# EAGLE design Aux Board V7.1 (EAGLE 9.6.2)

## Sheet 1 of 2
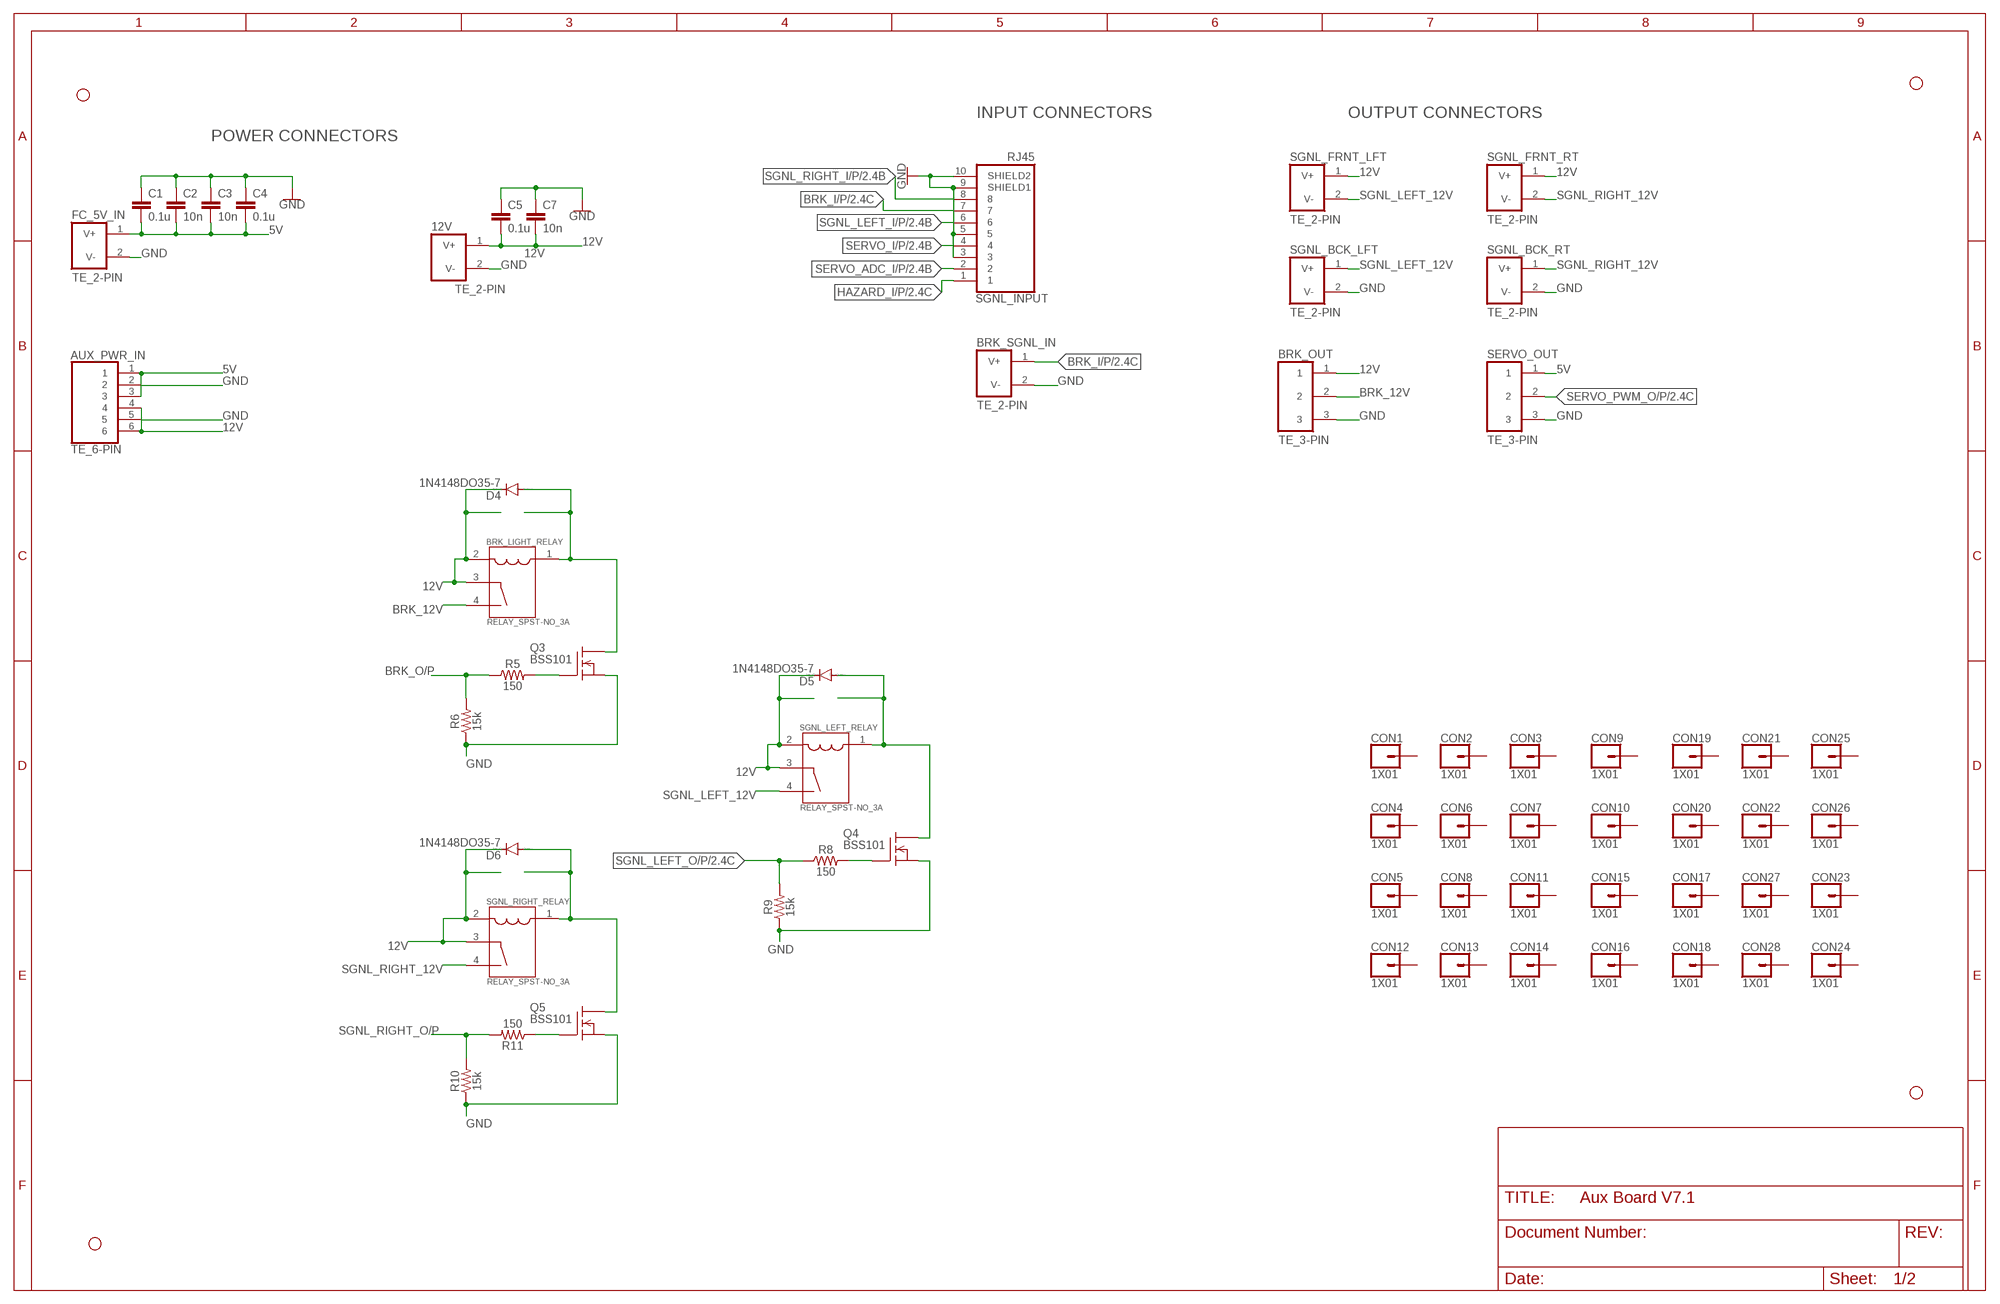
[diagram p0: schematic, sheet 1]

### Parts
12V  TE_2-PIN  [TE_2-PIN]
AUX_PWR_IN  TE_6-PIN  [TE_6-PIN]
BRK_LIGHT_RELAY  RELAY_SPST-NO_3A  [TE_1-1721081-2]
BRK_OUT  TE_3-PIN  [TE_3-PIN]
BRK_SGNL_IN  TE_2-PIN  [TE_2-PIN]
C1  0.1u  CAPACITOR_0805  [0805]
C2  10n  CAPACITOR_0805  [0805]
C3  10n  CAPACITOR_0805  [0805]
C4  0.1u  CAPACITOR_0805  [0805]
C5  0.1u  CAPACITOR_0805  [0805]
C7  10n  CAPACITOR_0805  [0805]
CON1  1X01  [1X01]
CON2  1X01  [1X01]
CON3  1X01  [1X01]
CON4  1X01  [1X01]
CON5  1X01  [1X01]
CON6  1X01  [1X01]
CON7  1X01  [1X01]
CON8  1X01  [1X01]
CON9  1X01  [1X01]
CON10  1X01  [1X01]
CON11  1X01  [1X01]
CON12  1X01  [1X01]
CON13  1X01  [1X01]
CON14  1X01  [1X01]
CON15  1X01  [1X01]
CON16  1X01  [1X01]
CON17  1X01  [1X01]
CON18  1X01  [1X01]
CON19  1X01  [1X01]
CON20  1X01  [1X01]
CON21  1X01  [1X01]
CON22  1X01  [1X01]
CON23  1X01  [1X01]
CON24  1X01  [1X01]
CON25  1X01  [1X01]
CON26  1X01  [1X01]
CON27  1X01  [1X01]
CON28  1X01  [1X01]
D4  1N4148DO35-7  [DO35-7]
D5  1N4148DO35-7  [DO35-7]
D6  1N4148DO35-7  [DO35-7]
FC_5V_IN  TE_2-PIN  [TE_2-PIN]
H1  STAND-OFF  [STAND-OFF]
H2  STAND-OFF  [STAND-OFF]
H3  STAND-OFF  [STAND-OFF]
H4  STAND-OFF  [STAND-OFF]
Q3  BSS101  [TO92]
Q4  BSS101  [TO92]
Q5  BSS101  [TO92]
R5  150  RESISTOR_0805  [0805]
R6  15k  RESISTOR_0805  [0805]
R8  150  RESISTOR_0805  [0805]
R9  15k  RESISTOR_0805  [0805]
R10  15k  RESISTOR_0805  [0805]
R11  150  RESISTOR_0805  [0805]
SERVO_OUT  TE_3-PIN  [TE_3-PIN]
SGNL_BCK_LFT  TE_2-PIN  [TE_2-PIN]
SGNL_BCK_RT  TE_2-PIN  [TE_2-PIN]
SGNL_FRNT_LFT  TE_2-PIN  [TE_2-PIN]
SGNL_FRNT_RT  TE_2-PIN  [TE_2-PIN]
SGNL_INPUT  RJ45  [RJ45]
SGNL_LEFT_RELAY  RELAY_SPST-NO_3A  [TE_1-1721081-2]
SGNL_RIGHT_RELAY  RELAY_SPST-NO_3A  [TE_1-1721081-2]

### Nets
5V: AUX_PWR_IN.1 AUX_PWR_IN.3 C1.2 C2.2 C3.2 C4.2 FC_5V_IN.1(V+) SERVO_OUT.1 ; also sheet 2
12V: 12V.1(V+) AUX_PWR_IN.4 AUX_PWR_IN.6 BRK_LIGHT_RELAY.2 BRK_LIGHT_RELAY.3 BRK_OUT.1 C5.2 C7.2 D4.C D5.C D6.C SGNL_FRNT_LFT.1(V+) SGNL_FRNT_RT.1(V+) SGNL_LEFT_RELAY.2 SGNL_LEFT_RELAY.3 SGNL_RIGHT_RELAY.2 SGNL_RIGHT_RELAY.3
BRK_12V: BRK_LIGHT_RELAY.4 BRK_OUT.2
BRK_I/P: BRK_SGNL_IN.1(V+) SGNL_INPUT.7 ; also sheet 2
BRK_O/P: R5.1 R6.2 ; also sheet 2
GND: 12V.2(V-) AUX_PWR_IN.2 AUX_PWR_IN.5 BRK_OUT.3 BRK_SGNL_IN.2(V-) C1.1 C2.1 C3.1 C4.1 C5.1 C7.1 FC_5V_IN.2(V-) Q3.1(S) Q4.1(S) Q5.1(S) R6.1 R9.1 R10.1 SERVO_OUT.3 SGNL_BCK_LFT.2(V-) SGNL_BCK_RT.2(V-) SGNL_INPUT.3 SGNL_INPUT.5 SGNL_INPUT.9(SHIELD1) SGNL_INPUT.10(SHIELD2) ; also sheet 2
HAZARD_I/P: SGNL_INPUT.1 ; also sheet 2
N$1: BRK_LIGHT_RELAY.1 D4.A Q3.3(D)
N$28: Q3.2(G) R5.2
N$32: D5.A Q4.3(D) SGNL_LEFT_RELAY.1
N$33: Q4.2(G) R8.2
N$35: D6.A Q5.3(D) SGNL_RIGHT_RELAY.1
N$37: Q5.2(G) R11.1
SERVO_ADC_I/P: SGNL_INPUT.2 ; also sheet 2
SERVO_I/P: SGNL_INPUT.4 ; also sheet 2
SERVO_PWM_O/P: SERVO_OUT.2 ; also sheet 2
SGNL_LEFT_12V: SGNL_BCK_LFT.1(V+) SGNL_FRNT_LFT.2(V-) SGNL_LEFT_RELAY.4
SGNL_LEFT_I/P: SGNL_INPUT.6 ; also sheet 2
SGNL_LEFT_O/P: R8.1 R9.2 ; also sheet 2
SGNL_RIGHT_12V: SGNL_BCK_RT.1(V+) SGNL_FRNT_RT.2(V-) SGNL_RIGHT_RELAY.4
SGNL_RIGHT_I/P: SGNL_INPUT.8 ; also sheet 2
SGNL_RIGHT_O/P: R10.2 R11.2 ; also sheet 2
Unconnected: CON1.1 CON2.1 CON3.1 CON4.1 CON5.1 CON6.1 CON7.1 CON8.1 CON9.1 CON10.1 CON11.1 CON12.1 CON13.1 CON14.1 CON15.1 CON16.1 CON17.1 CON18.1 CON19.1 CON20.1 CON21.1 CON22.1 CON23.1 CON24.1 CON25.1 CON26.1 CON27.1 CON28.1

### Notes on the sheet
- INPUT CONNECTORS | OUTPUT CONNECTORS
- POWER CONNECTORS

## Sheet 2 of 2
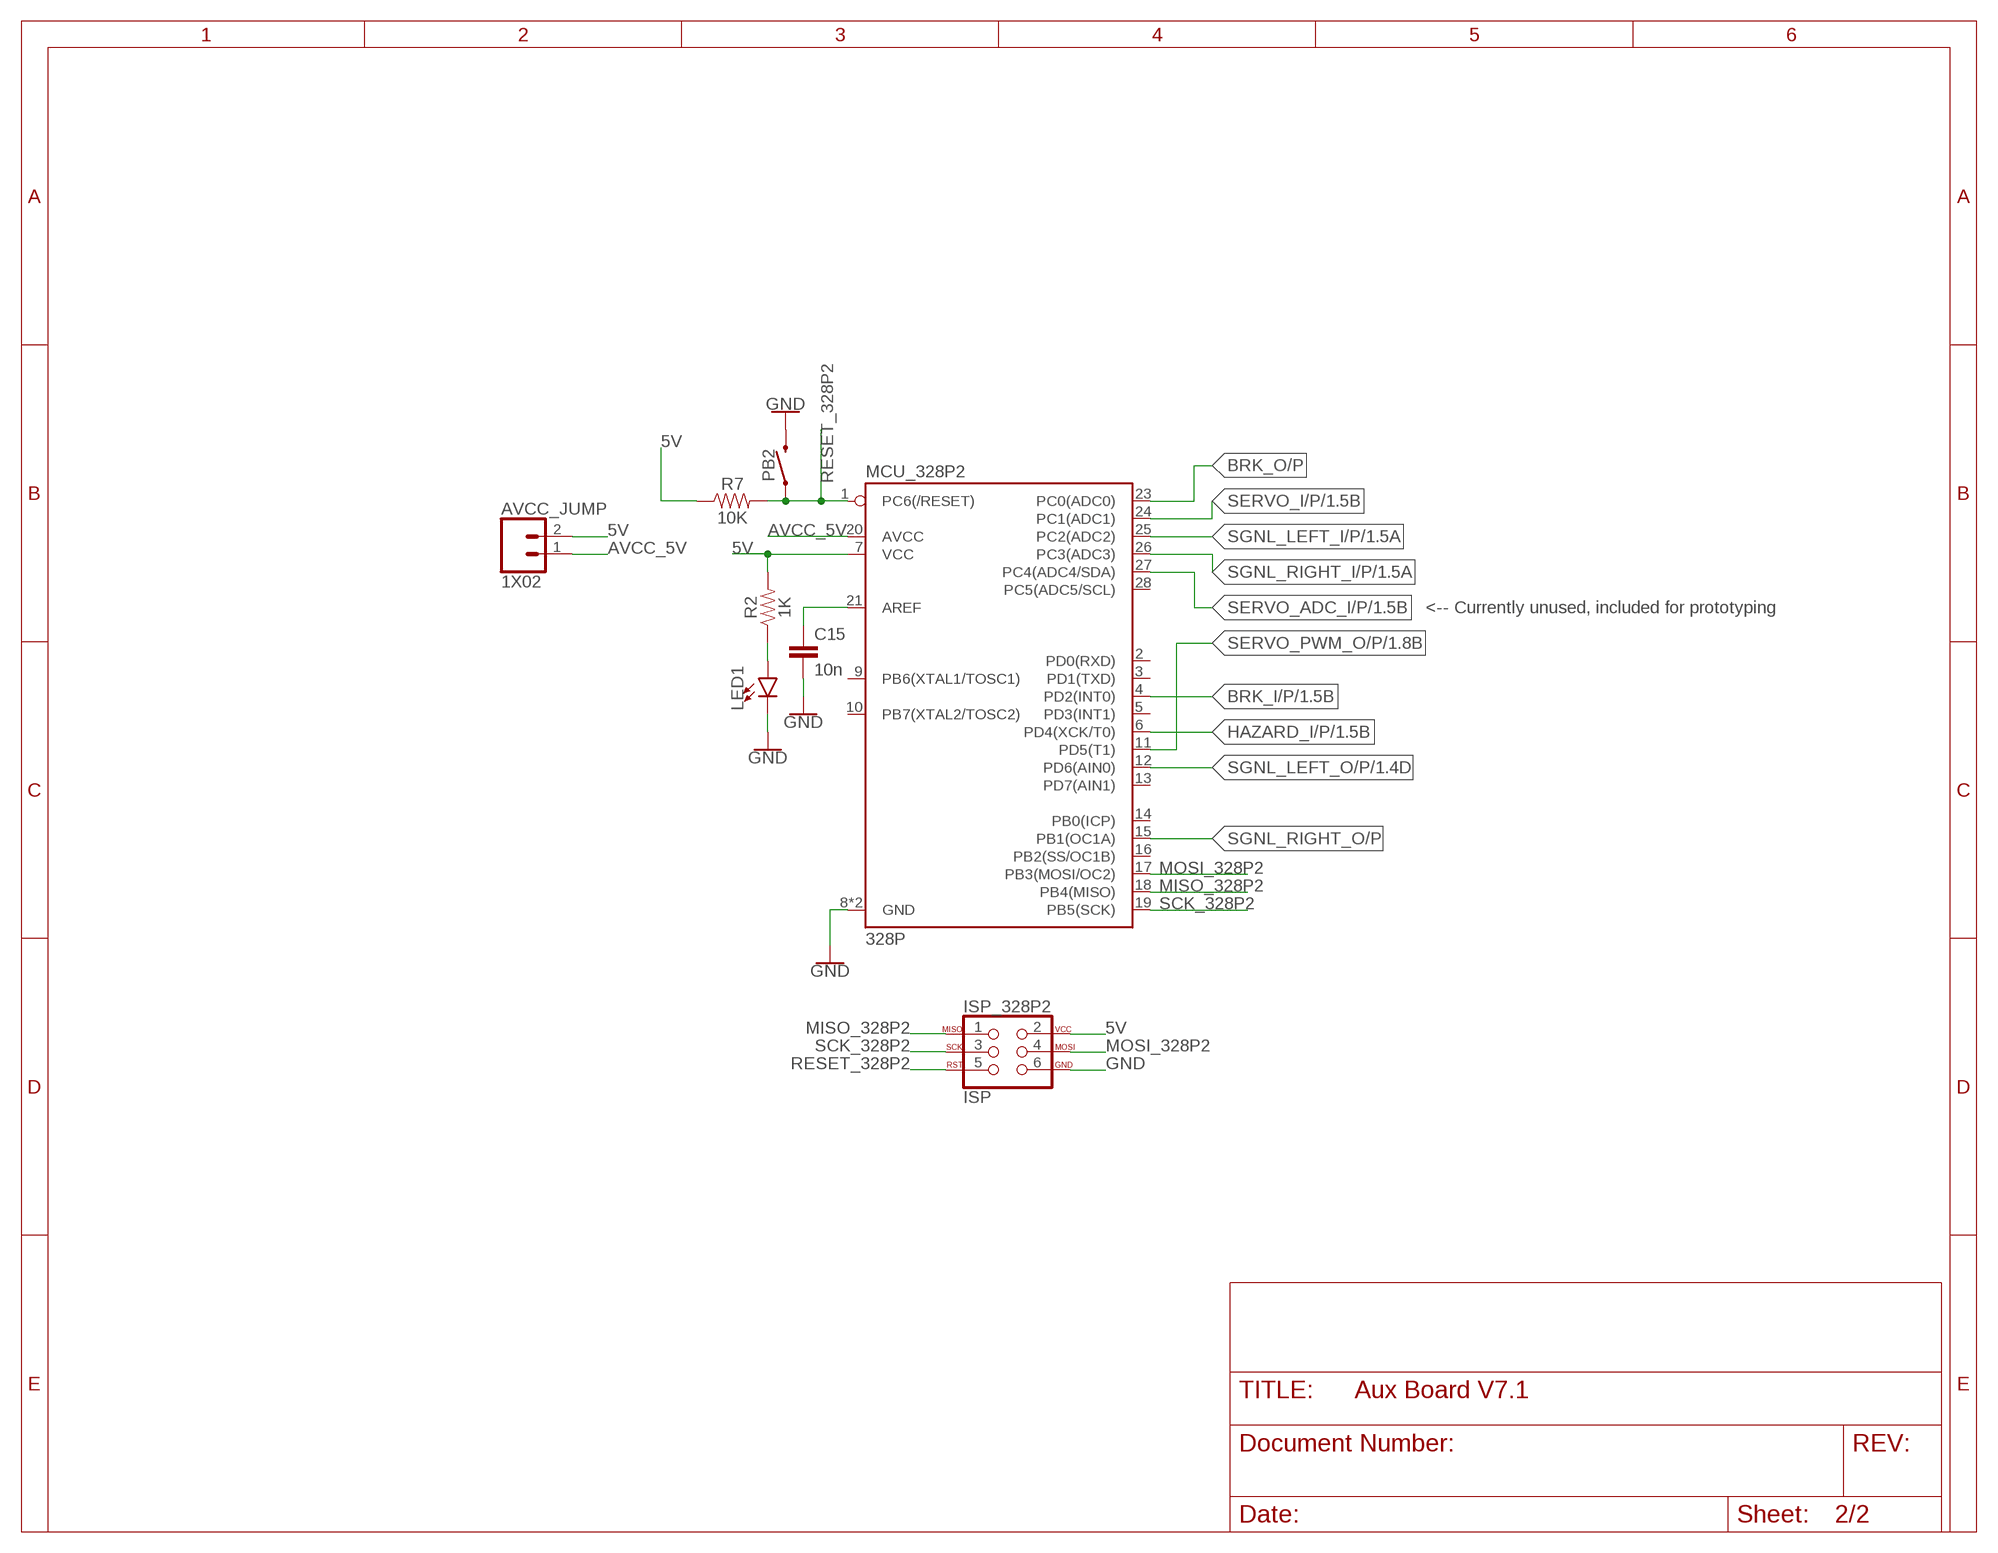
[diagram p1: schematic, sheet 2]

### Parts
AVCC_JUMP  1X02  [1X02]
C15  10n  CAPACITOR_0805  [0805]
ISP_328P2  ISP  [ISP_CONNECTOR]
LED1  LED_0805  [0805_LED]
MCU_328P2  328P  ATMEGA328P_DIP28  [DIP28]
PB2  PUSHBUTTON  [PUSHBUTTON]
R2  1K  RESISTOR_0805  [0805]
R7  10K  RESISTOR_0805  [0805]

### Nets
5V: AVCC_JUMP.2 ISP_328P2.2 MCU_328P2.7(VCC) R2.2 R7.1 ; also sheet 1
AREF: C15.1 MCU_328P2.21(AREF)
AVCC_5V: AVCC_JUMP.1 MCU_328P2.20(AVCC)
BRK_I/P: MCU_328P2.4(PD2(INT0)) ; also sheet 1
BRK_O/P: MCU_328P2.23(PC0(ADC0)) ; also sheet 1
GND: C15.2 ISP_328P2.6 LED1.2(C) MCU_328P2.8(GND) MCU_328P2.22(GND) PB2.3 PB2.4 ; also sheet 1
HAZARD_I/P: MCU_328P2.6(PD4(XCK/T0)) ; also sheet 1
MISO_328P2: ISP_328P2.1 MCU_328P2.18(PB4(MISO))
MOSI_328P2: ISP_328P2.4 MCU_328P2.17(PB3(MOSI/OC2))
N$8: LED1.1(A) R2.1
RESET_328P2: ISP_328P2.5 MCU_328P2.1(PC6(/RESET)) PB2.1 PB2.2 R7.2
SCK_328P2: ISP_328P2.3 MCU_328P2.19(PB5(SCK))
SERVO_ADC_I/P: MCU_328P2.27(PC4(ADC4/SDA)) ; also sheet 1
SERVO_I/P: MCU_328P2.24(PC1(ADC1)) ; also sheet 1
SERVO_PWM_O/P: MCU_328P2.11(PD5(T1)) ; also sheet 1
SGNL_LEFT_I/P: MCU_328P2.25(PC2(ADC2)) ; also sheet 1
SGNL_LEFT_O/P: MCU_328P2.12(PD6(AIN0)) ; also sheet 1
SGNL_RIGHT_I/P: MCU_328P2.26(PC3(ADC3)) ; also sheet 1
SGNL_RIGHT_O/P: MCU_328P2.15(PB1(OC1A)) ; also sheet 1
Unconnected: MCU_328P2.2(PD0(RXD)) MCU_328P2.3(PD1(TXD)) MCU_328P2.5(PD3(INT1)) MCU_328P2.9(PB6(XTAL1/TOSC1)) MCU_328P2.10(PB7(XTAL2/TOSC2)) MCU_328P2.13(PD7(AIN1)) MCU_328P2.14(PB0(ICP)) MCU_328P2.16(PB2(SS/OC1B)) MCU_328P2.28(PC5(ADC5/SCL))

### Notes on the sheet
- <-- Currently unused, included for prototyping

## Library data of the parts
12V BRK_SGNL_IN FC_5V_IN SGNL_BCK_LFT SGNL_BCK_RT SGNL_FRNT_LFT SGNL_FRNT_RT = EcoCar-Connectors:TE_2-PIN: 2 Pin TE Mini-Universal MATE-N-LOK - Use for signals and power connections Part Number: 1-770966-0 Digikey Part Number: A32471-ND Matching Plug: A25587-ND Matching Crimps: A100828CT-ND
AUX_PWR_IN = EcoCar-Connectors:TE_6-PIN: 6 Pin TE Mini-Universal MATE-N-LOK Part Number: 1-770969-0 Digikey Part Number: A32475-ND Matching Plug: A97674-ND Matching Crimps: A100828CT-ND
AVCC_JUMP = EcoCar-Connectors-2.54mm:1X02: 2.54mm (0.1") Header
BRK_LIGHT_RELAY SGNL_LEFT_RELAY SGNL_RIGHT_RELAY = EcoCar-Electromechanical:RELAY_SPST-NO_3A: 3A SPST-NO Relay Manufacturer: TE Connectivity Part Number: PCJ-105D3M,301 Digikey Part Number: PB2070-ND Ratings: 5VDC coil voltage 40mA coil current 30VDC/250VAC switching voltage 3A contact rating Electromechanical Relay 12VDC 720Ohm 3A SPST-NO (20.4x7x15)mm THT Power Relay Check availability <https://pricing.snapeda.com/parts/1-1721081-2/TE%20Connectivity/view-part?ref=eda>; AVAILABILITY: In Stock; COMMENT: 1-1721081-2; DESCRIPTION: General Purpose Relay SPST-NO (1 Form A) 12VDC Coil Through Hole; MF: TE Connectivity; MP: 1-1721081-2; PACKAGE: None; PRICE: None
BRK_OUT SERVO_OUT = EcoCar-Connectors:TE_3-PIN: 3 Pin TE Mini-Universal MATE-N-LOK Part Number: 1-770967-0 Digikey Part Number: A32473-ND Matching Plug: A25588-ND Matching Crimps: A100828CT-ND
C1-C5 C7 C15 = EcoCar-Passives:CAPACITOR_0805
CON1-CON28 = EcoCar-Connectors-2.54mm:1X01: 2.54mm (0.1") Header
D4-D6 = diode:1N4148: DIODE high speed (Philips)
H1-H4 = EcoCar-Miscellaneous:STAND-OFF: Stand Off Drill holes for mechanically mounting via screws, standoffs, etc. Note: Use the keepout ring to avoid running the screw head into surrounding components. Variant Overviews STAND-OFF - Mechanical footprint for a #4 phillips button head screw. STAND-OFF-TIGHT - Mechanical footprint for a #4 phillips button head screw, Example SparkFun Products Screw - Phillips Head (1/4", 4-40, 10 pack) <https://www.sparkfun.com/products/10453> (PRT-10453) Screw - Phillips Head (1/2", 4-40, 10 pack) <https://www.sparkfun.com/products/10452> (PRT-10452) Screw - Phillips Head (3/4", 4-40, 10 pack) <https://www.sparkfun.com/products/10451> (PRT-10451) Screw - Phillips Head (1", 4-40, 10 pack) <https://www.sparkfun.com/products/10450> (PRT-10450)
ISP_328P2 = EcoCar-Microcontrollers:ISP: ISP Header Use for programming microcontrollers such as the 328P
LED1 = EcoCar-Discrete-Semiconductors:LED_0805
MCU_328P2 = EcoCar-Microcontrollers:ATMEGA328P_DIP28: ATmega328P Manufacturer: Microchip Part Number: ATMEGA328P-PU Digikey Part Number: ATMEGA328P-PU-ND; PROD_ID: IC-09136
PB2 = EcoCar-Electromechanical:PUSHBUTTON: Pushbutton Manufacturer: TE Connectivity ALCOSWITCH Switches Part Number: 1825910-6 Digikey Part Number: 450-1650-ND
Q3-Q5 = transistor-fet:BSS101: N-Channel Enhancement MOSFET 200V; 0,16A; 11Ohm
R2 R5-R11 = EcoCar-Passives:RESISTOR_0805
SGNL_INPUT = EcoCar-Connectors:RJ45: RJ45 Connector - Use for signals and low power connections Unshielded Part Number: RJHSE-5080 Unshielded Digikey Part Number: RJHSE-5080-ND Shielded Part Number: RJHSE5E80 Shielded Digikey Part Number: RJHSE5E80-ND

## Board
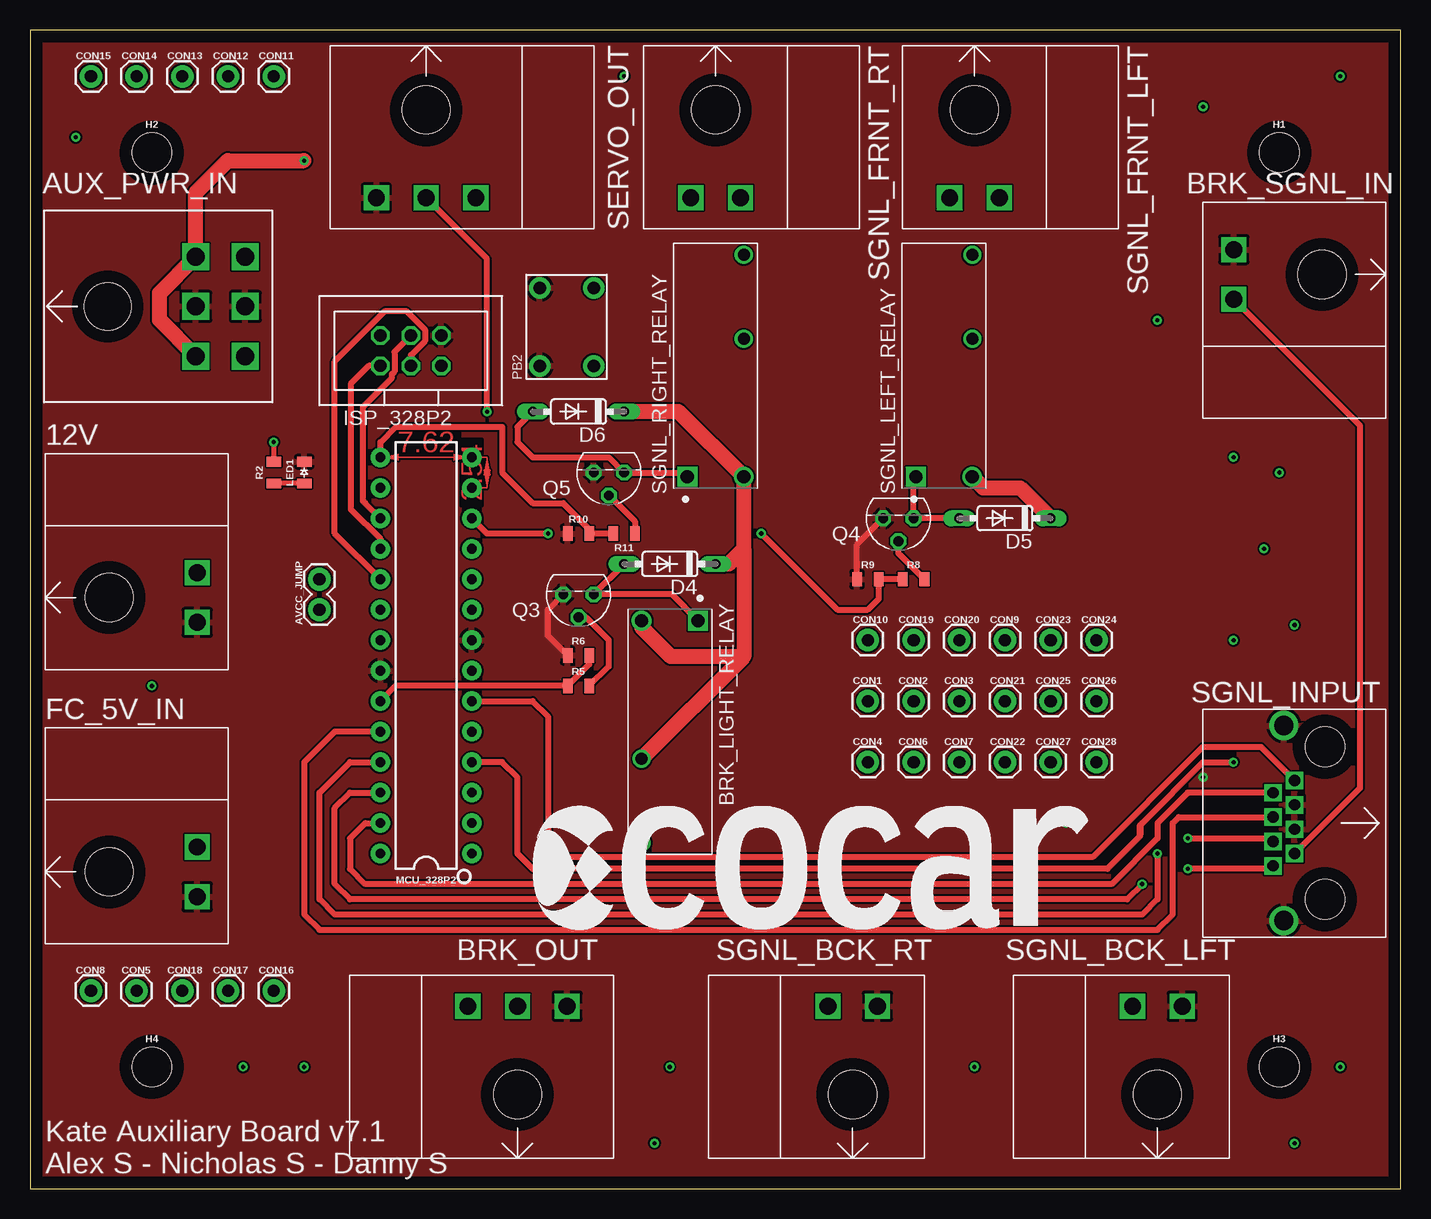
[diagram p2: board, top side]
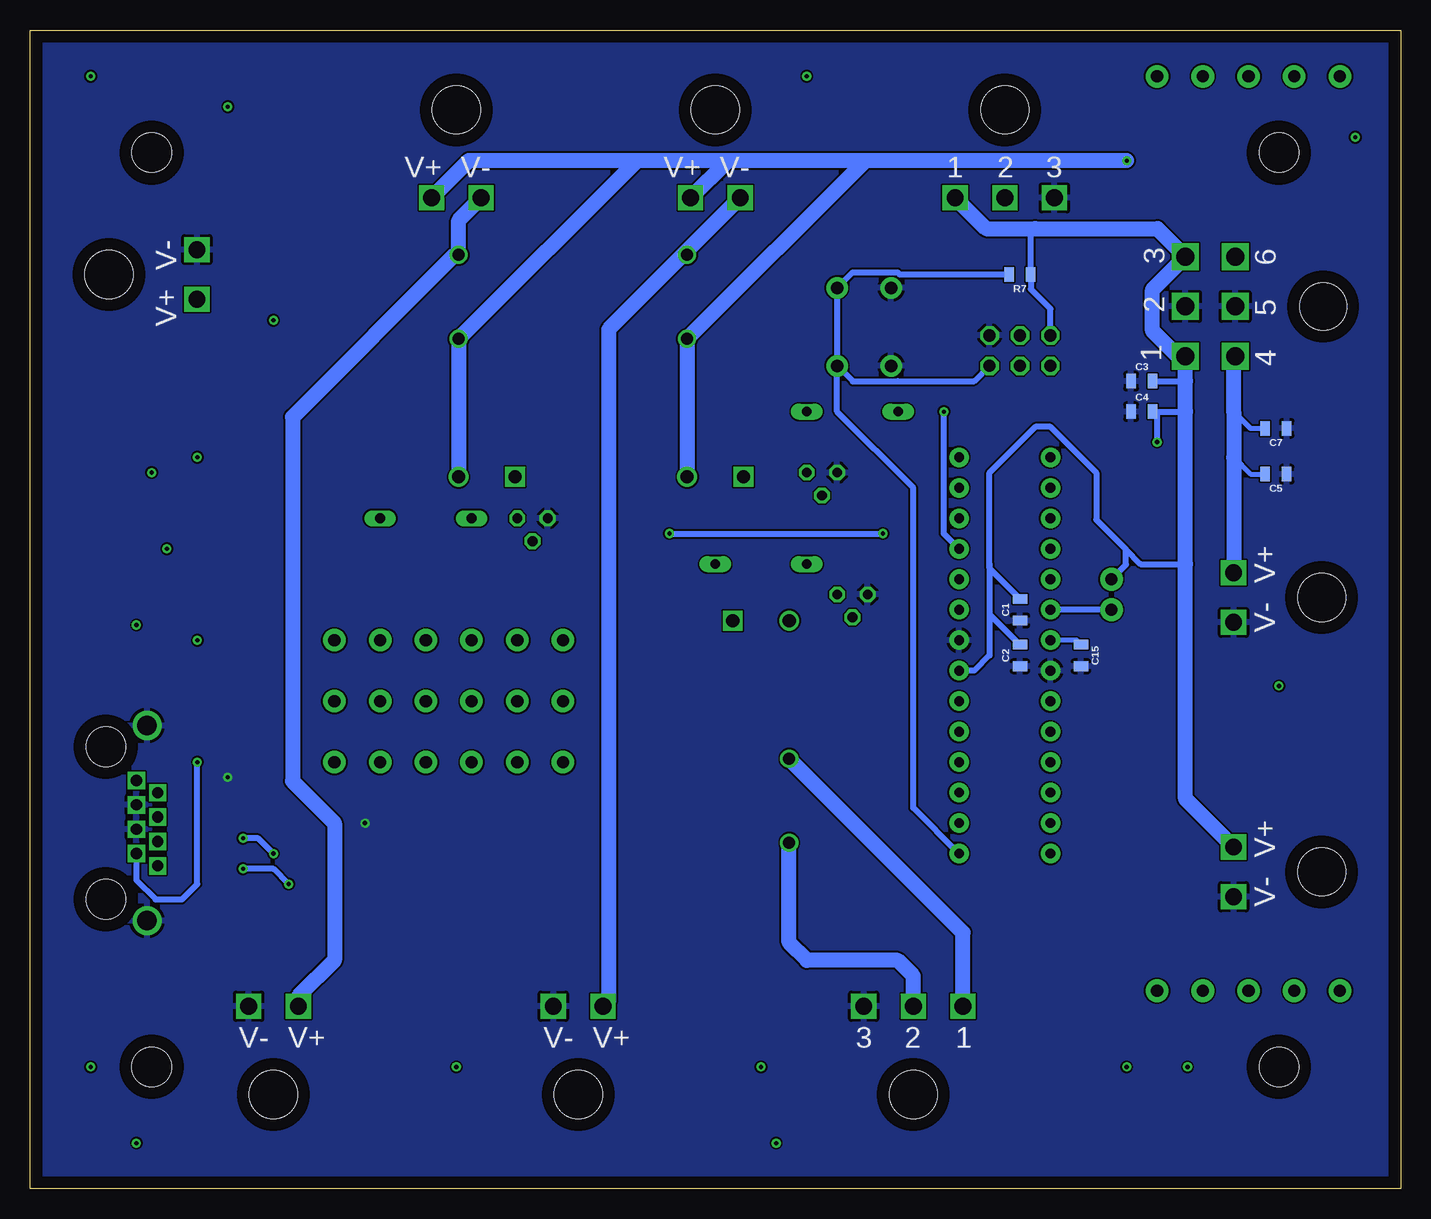
[diagram p3: board, bottom side, seen from below]

Size 114.28 x 96.57 mm. Coordinates in mm from the lower left corner, seen from the top.
Outline: 0,0 114.28,0 114.28,96.57 0,96.57 0,0
Copper layers (1*16): Top 0.035mm / dielectric 1.5mm / Bottom 0.035mm
Design rules "default": minimum track width 6mil, minimum drill 0.35mm, track to track 6mil, track to pad 6mil, pad to pad 6mil, via to via 6mil, smd to smd 6mil, copper to edge 40mil, drill to drill 6mil, minimum pad ring 10mil, minimum via ring 8mil, stop-mask expansion 4mil, vias tented up to drill 0mil, thermal gap 10mil

### Footprints (pad centres in the part's own frame; a part is rotated, then mirrored left to right if it is on the bottom)
TE_2-PIN = drill 1.4 square: 1 -2.07,12.67; 2 2.07,12.67 | hole 4: 0,5.33
TE_6-PIN = drill 1.5 square: 1 4.14,11.48; 2 0,11.48; 3 -4.14,11.48; 4 4.14,7.34; 5 0,7.34; 6 -4.14,7.34 | hole 3.91: 0,0
1X02 = drill 1.016 pad 1.88: 1 0,0; 2 2.54,0
TE_1-1721081-2 = drill 1.1 square: 1 -9.25,2.35 | drill 1.1: 2 -9.25,-2.35 | drill 1: 3 2.25,-2.35; 4 9.25,-2.35
TE_3-PIN = drill 1.4 square: 1 -4.14,12.67; 2 0,12.67; 3 4.14,12.67 | hole 4: 0,5.33
0805 = smd 0.8 x 1.2: 1 -0.9,0; 2 0.9,0
1X01 = drill 1.016 pad 1.88: 1 0,0
DO35-7 = drill 0.813 long: A 3.81,0; C -3.81,0
STAND-OFF = hole 3.302: 0,0
ISP_CONNECTOR = drill 1.016 octagon: 1 2.54,1.27; 2 2.54,-1.27; 3 0,1.27; 4 0,-1.27; 5 -2.54,1.27; 6 -2.54,-1.27
0805_LED = smd 0.8 x 1.2: 1 -0.9,0; 2 0.9,0
DIP28 = drill 0.813 pad 1.626: 1 -16.51,-3.81; 2 -13.97,-3.81; 3 -11.43,-3.81; 4 -8.89,-3.81; 5 -6.35,-3.81; 6 -3.81,-3.81; 7 -1.27,-3.81; 8 1.27,-3.81; 9 3.81,-3.81; 10 6.35,-3.81; 11 8.89,-3.81; 12 11.43,-3.81; 13 13.97,-3.81; 14 16.51,-3.81; 15 16.51,3.81; 16 13.97,3.81; 17 11.43,3.81; 18 8.89,3.81; 19 6.35,3.81; 20 3.81,3.81; 21 1.27,3.81; 22 -1.27,3.81; 23 -3.81,3.81; 24 -6.35,3.81; 25 -8.89,3.81; 26 -11.43,3.81; 27 -13.97,3.81; 28 -16.51,3.81
PUSHBUTTON = drill 1.04 pad 1.778: 1 0,0; 2 6.5,0; 3 0,4.5; 4 6.5,4.5
TO92 = drill 0.813 octagon: 1 1.27,0; 2 0,1.905; 3 -1.27,0
RJ45 = drill 0.94 square: 1 9.9,2.54; 2 8.88,4.32; 3 7.87,2.54; 4 6.85,4.32; 5 5.84,2.54; 6 4.82,4.32; 7 3.81,2.54; 8 2.79,4.32 | drill 1.62: 9 -1.78,3.43; 10 14.48,3.43 | hole 3.3: 0,0; 12.7,0

### Placement (x,y rotation side)
12V  1.27,49.28 270 top
AUX_PWR_IN  6.48,73.53 270 top
AVCC_JUMP  24.13,48.26 90 top
BRK_LIGHT_RELAY  53.34,38.1 270 top
BRK_OUT  40.64,2.54 0 top
BRK_SGNL_IN  113.03,76.2 90 top
C1  31.75,48.26 90 bottom
C2  31.75,44.45 90 bottom
C3  21.59,67.31 0 bottom
C4  21.59,64.77 0 bottom
C5  10.41,59.56 180 bottom
C7  10.41,63.37 180 bottom
C15  26.67,44.45 270 bottom
CON1  69.85,40.64 0 top
CON2  73.66,40.64 0 top
CON3  77.47,40.64 0 top
CON4  69.85,35.56 0 top
CON5  8.89,16.51 0 top
CON6  73.66,35.56 0 top
CON7  77.47,35.56 0 top
CON8  5.08,16.51 0 top
CON9  81.28,45.72 0 top
CON10  69.85,45.72 0 top
CON11  20.32,92.71 0 top
CON12  16.51,92.71 0 top
CON13  12.7,92.71 0 top
CON14  8.89,92.71 0 top
CON15  5.08,92.71 0 top
CON16  20.32,16.51 0 top
CON17  16.51,16.51 0 top
CON18  12.7,16.51 0 top
CON19  73.66,45.72 0 top
CON20  77.47,45.72 0 top
CON21  81.28,40.64 0 top
CON22  81.28,35.56 0 top
CON23  85.09,45.72 0 top
CON24  88.9,45.72 0 top
CON25  85.09,40.64 0 top
CON26  88.9,40.64 0 top
CON27  85.09,35.56 0 top
CON28  88.9,35.56 0 top
D4  53.34,52.07 180 top
D5  81.28,55.88 180 top
D6  45.72,64.77 180 top
FC_5V_IN  1.27,26.42 270 top
H1  104.14,86.36 0 top
H2  10.16,86.36 0 top
H3  104.14,10.16 0 top
H4  10.16,10.16 0 top
ISP_328P2  31.75,69.85 180 top
LED1  22.86,59.69 90 top
MCU_328P2  33.02,44.45 90 top
PB2  46.99,68.58 90 top
Q3  45.72,49.53 180 top
Q4  72.39,55.88 180 top
Q5  48.26,59.69 180 top
R2  20.32,59.69 90 top
R5  45.72,41.91 0 top
R6  45.72,44.45 0 top
R7  31.75,76.2 180 bottom
R8  73.66,50.8 0 top
R9  69.85,50.8 0 top
R10  45.72,54.61 0 top
R11  49.53,54.61 180 top
SERVO_OUT  33.02,95.25 180 top
SGNL_BCK_LFT  93.98,2.54 0 top
SGNL_BCK_RT  68.58,2.54 0 top
SGNL_FRNT_LFT  78.74,95.25 180 top
SGNL_FRNT_RT  57.15,95.25 180 top
SGNL_INPUT  107.95,24.13 90 top
SGNL_LEFT_RELAY  76.2,68.58 90 top
SGNL_RIGHT_RELAY  57.15,68.58 90 top
U$1  [ECOCAR_LOGO_2018]  41.91,21.59 0 top

### Tracks (layer width: path | path; a pad name or v marks a point on that pad's centre or on a via)
5V  (via drill 0.35)
  Top 0.406: v20.32,62.23 R2.2
  Bottom 0.406: 34.29,47.89 34.29,51.7 34.29,52.07 34.29,59.69 | 30.85,79.64 30.48,80.01
  Bottom 0.508: 34.29,47.89 34.29,44.45 35.56,43.18 MCU_328P2.7 | C2.2 34.29,47.89 | C1.2 34.29,51.7 34.29,59.69 30.48,63.5 29.21,63.5 25.4,59.69 25.4,55.76 22.92,53.28 | 34.29,52.07 34.29,47.89 | 22.92,53.28 21.71,52.07 17.96,52.07 | ISP_328P2.2 29.21,73.33 30.85,74.97 R7.1 30.85,79.64 | v20.32,62.23 20.32,64.4 C4.2 17.96,64.77 | C3.2 17.96,67.31 | AVCC_JUMP.2 22.92,52.01 22.92,53.28
  Bottom 1.27: SERVO_OUT.1 34.59,80.01 30.48,80.01 20.29,80.01 AUX_PWR_IN.3 20.7,74.93 20.7,71.5 18.59,69.39 AUX_PWR_IN.1 17.96,67.31 17.96,64.77 17.96,52.07 17.96,32.5 FC_5V_IN.1
12V  (via drill 0.35)
  Top 1.27: AUX_PWR_IN.4 10.79,72.42 10.79,74.65 AUX_PWR_IN.6 13.82,83.01 16.5,85.69 v22.85,85.69 | BRK_LIGHT_RELAY.3 59.5,44.36 | 59.5,53.34 59.5,44.36 | 59.5,53.34 SGNL_RIGHT_RELAY.2 54.06,64.77 D6.C | SGNL_LEFT_RELAY.2 79.46,58.42 82.55,58.42 D5.C | 59.5,53.34 58.23,52.07 D4.C | 59.5,44.36 53.43,44.36 50.99,46.8 BRK_LIGHT_RELAY.2
  Bottom 0.406: 13.94,64.77 12.54,63.37 C7.2 | 13.94,60.96 12.54,59.56 C5.2
  Bottom 1.27: v22.85,85.69 44.64,85.69 | 44.64,85.69 56.11,85.69 | SGNL_FRNT_RT.1 56.11,85.69 | 56.11,85.69 63.69,85.69 | 63.69,85.69 77.7,85.69 SGNL_FRNT_LFT.1 | BRK_OUT.1 36.5,21.36 BRK_LIGHT_RELAY.3 | 63.69,85.69 SGNL_LEFT_RELAY.3 SGNL_LEFT_RELAY.2 | 44.64,85.69 SGNL_RIGHT_RELAY.3 SGNL_RIGHT_RELAY.2 | AUX_PWR_IN.4 13.94,69.27 13.94,64.77 13.94,60.96 12V.1
AREF
  Bottom 0.406: C15.1 27.04,45.72 MCU_328P2.21
AVCC_5V
  Bottom 0.508: AVCC_JUMP.1 MCU_328P2.20
BRK_12V
  Bottom 1.27: BRK_OUT.2 40.64,17.75 41.94,19.05 49.53,19.05 50.99,20.51 BRK_LIGHT_RELAY.4
BRK_I/P  (via drill 0.35)
  Top 0.203: 92.71,30.48 92.71,29.57 92.53,29.39
  Top 0.508: v100.33,35.56 97.79,35.56 92.71,30.48 92.53,30.3 92.53,29.39 89.81,26.67 41.91,26.67 40.64,27.94 40.64,34.29 39.37,35.56 MCU_328P2.4 | BRK_SGNL_IN.1 110.87,63.62 110.87,33.4 SGNL_INPUT.7
  Bottom 0.508: SGNL_INPUT.7 105.41,25.72 103.82,24.13 101.6,24.13 100.33,25.4 v100.33,35.56
BRK_O/P
  Top 0.508: R6.2 46.62,43.71 R5.1 30.48,41.91 MCU_328P2.23
GND  (via drill 0.35)
  Top 0.508: R6.1 43.18,46.09 43.18,48.26 Q3.1 | R9.1 68.95,53.71 Q4.1
  other vias: 97.79,34.29 86.36,30.48
  pour Bottom: -2.54,99.06 116.84,99.06 116.84,-2.54 -2.54,-2.54
  pour Top: -1.27,97.79 115.57,97.79 115.57,-1.27 -1.27,-1.27
HAZARD_I/P
  Top 0.508: MCU_328P2.6 41.91,40.64 43.18,39.37 43.18,29.21 44.7,27.69 88.65,27.69 97.79,36.83 102.61,36.83 SGNL_INPUT.1
MISO_328P2
  Top 0.508: ISP_328P2.1 28.24,68.58 26.75,67.09 26.75,56.62 29.21,54.16 MCU_328P2.18
MOSI_328P2
  Top 0.203: 27.95,57.16 27.76,57.34 27.76,65.19
  Top 0.508: MCU_328P2.17 27.95,57.14 | 27.95,57.16 27.95,57.14 | 27.95,57.14 27.76,57.33 27.76,65.19 30.18,67.61 30.18,67.9 30.38,68.1 30.38,69.75 ISP_328P2.4
N$1
  Top 0.508: BRK_LIGHT_RELAY.1 53.51,49.53 Q3.3 D4.A
N$3  (via drill 0.35)
  other vias: 102.87,53.34
N$6  (via drill 0.35)
  other vias: 93.98,72.39
N$7  (via drill 0.35)
  other vias: 97.79,90.17
N$8
  Top 0.406: LED1.1 R2.1
N$9  (via drill 0.35)
  other vias: 109.22,92.71
N$10  (via drill 0.35)
  other vias: 78.74,10.16
N$11  (via drill 0.35)
  other vias: 53.34,10.16
N$12  (via drill 0.35)
  other vias: 17.78,10.16
N$15  (via drill 0.35)
  other vias: 3.81,87.63
N$16  (via drill 0.35)
  other vias: 105.41,3.81
N$19  (via drill 0.35)
  other vias: 100.33,45.72
N$20  (via drill 0.35)
  other vias: 100.33,60.96
N$21  (via drill 0.35)
  other vias: 104.14,59.69
N$22  (via drill 0.35)
  other vias: 49.53,92.71
N$23  (via drill 0.35)
  other vias: 10.16,41.91
N$24  (via drill 0.35)
  other vias: 105.41,46.99
N$26  (via drill 0.35)
  other vias: 109.22,10.16
N$27  (via drill 0.35)
  other vias: 52.07,3.81
N$28
  Top 0.508: R5.2 48.26,43.55 48.26,45.72 46.35,47.62 Q3.2
N$30  (via drill 0.35)
  other vias: 22.86,10.16
N$32
  Top 0.508: SGNL_LEFT_RELAY.1 73.66,59.14 Q4.3 D5.A
N$33
  Top 0.508: R8.2 72.39,52.97 Q4.2
N$35
  Top 0.508: SGNL_RIGHT_RELAY.1 54.44,59.69 Q5.3 48.26,60.96 41.91,60.96 40.64,62.23 40.64,63.5 D6.A
N$37
  Top 0.508: Q5.2 50.43,55.62 R11.1
RESET_328P2
  Bottom 0.508: MCU_328P2.1 40.64,31.75 40.64,58.42 46.99,64.77 PB2.1 | PB2.1 PB2.2 45.7,76.38 41.95,76.38 41.78,76.2 R7.2 | PB2.1 45.7,67.28 41.95,67.28 41.93,67.31 35.56,67.31 ISP_328P2.5
SCK_328P2
  Top 0.508: ISP_328P2.3 31.75,69.47 32.92,70.64 32.92,71.6 31.35,73.17 29.61,73.17 25.4,68.96 25.4,54.61 MCU_328P2.19
SERVO_ADC_I/P
  Top 0.508: SGNL_INPUT.2 96.53,33.01 96.52,33.02 93.98,30.48 93.98,29.21 90.17,25.4 27.94,25.4 26.67,26.67 26.67,29.21 27.94,30.48 MCU_328P2.27
SERVO_I/P
  Top 0.508: MCU_328P2.24 25.4,38.1 22.86,35.56 22.86,22.86 24.13,21.59 93.98,21.59 95.25,22.86 95.25,30.48 95.75,30.98 SGNL_INPUT.4
SERVO_PWM_O/P  (via drill 0.35)
  Top 0.508: SERVO_OUT.2 38.1,77.5 v38.1,64.77
  Bottom 0.508: MCU_328P2.11 38.1,54.61 v38.1,64.77
SGNL_LEFT_12V
  Bottom 1.27: SGNL_FRNT_LFT.2 78.55,80.7 SGNL_LEFT_RELAY.4 78.88,77.83 92.39,64.31 92.39,33.98 88.9,30.48 88.9,19.05 91.91,16.04 SGNL_BCK_LFT.1
SGNL_LEFT_I/P  (via drill 0.35)
  Top 0.508: MCU_328P2.25 26.67,35.56 24.13,33.02 24.13,24.13 25.4,22.86 92.71,22.86 93.98,24.13 v93.98,27.94 | v96.52,29.21 103.37,29.21 SGNL_INPUT.6
  Bottom 0.508: v93.98,27.94 95.25,29.21 v96.52,29.21
SGNL_LEFT_O/P  (via drill 0.35)
  Top 0.508: v43.18,54.61 38.1,54.61 MCU_328P2.12 | v60.96,54.61 67.31,48.26 69.85,48.26 70.75,49.16 R9.2 R8.1
  Bottom 0.508: v60.96,54.61 v43.18,54.61
SGNL_RIGHT_12V
  Bottom 1.27: SGNL_FRNT_RT.2 59.5,78.16 | 59.5,78.16 SGNL_RIGHT_RELAY.4 | 59.5,78.16 66.04,71.62 66.04,15.68 SGNL_BCK_RT.1
SGNL_RIGHT_I/P  (via drill 0.35)
  Top 0.508: MCU_328P2.26 26.67,33.02 25.4,31.75 25.4,25.4 26.67,24.13 91.44,24.13 v92.71,25.4 | SGNL_INPUT.8 103.38,26.67 v96.52,26.67
  Bottom 0.508: v92.71,25.4 93.98,26.67 v96.52,26.67
SGNL_RIGHT_O/P
  Top 0.508: R11.2 R10.2 46.62,54.98 44.45,57.15 41.91,57.15 39.37,59.69 39.37,63.5 30.48,63.5 29.21,62.23 MCU_328P2.15
(copper drawn outside any net)
  shapes: Top area x2

### Text on the board
tNames: Kate Auxiliary Board v7.1 / Alex S - Nicholas S - Danny S